# EAGLE design Teensy MouseV2.0 (EAGLE 6.5.0)
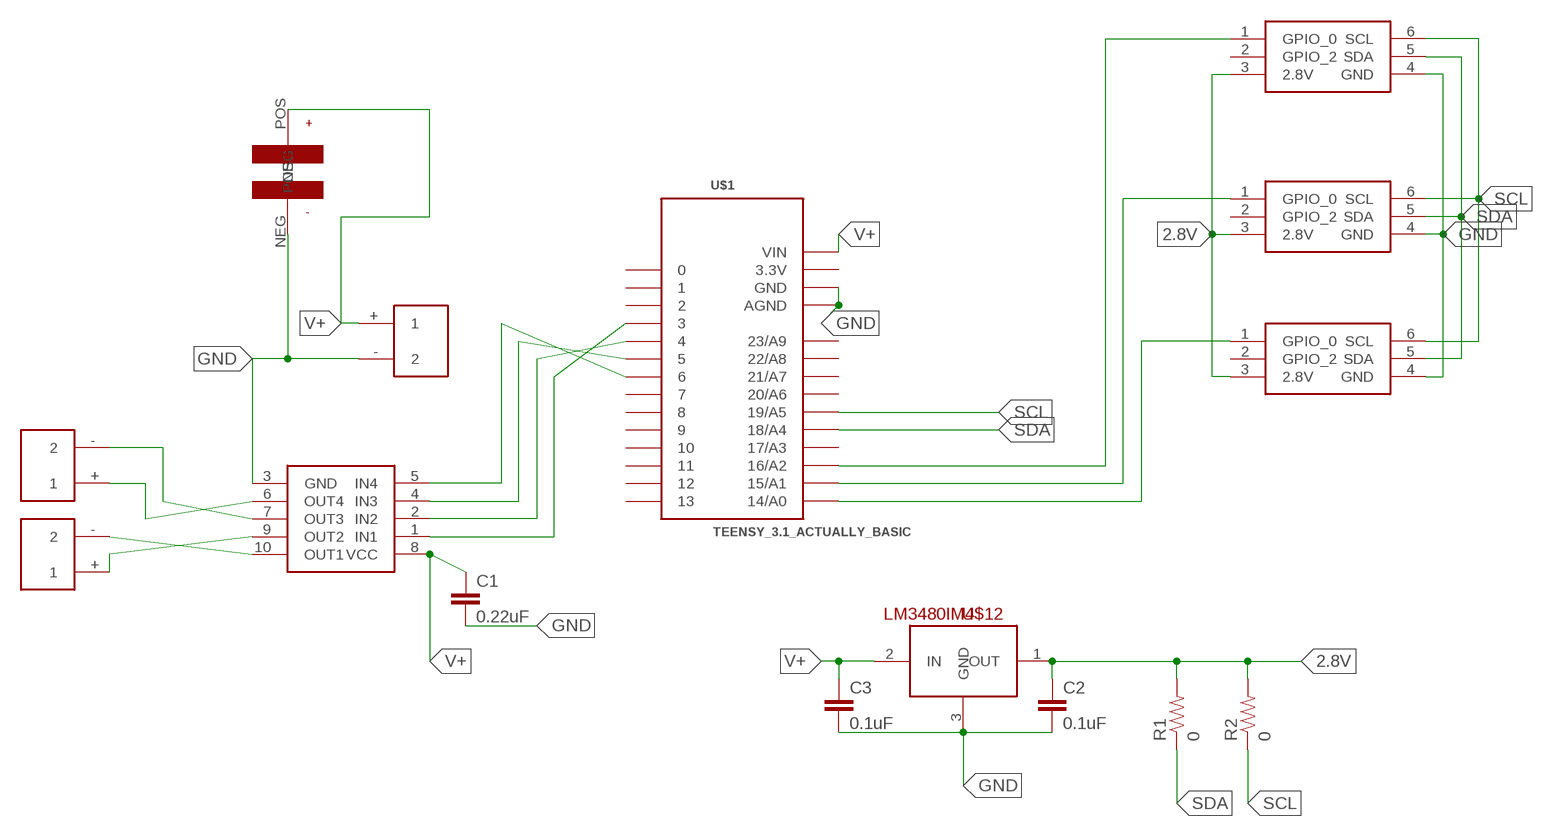
[diagram p0: schematic, sheet 1]

## Parts
C1  0.22uF  0.22UF50V-20%,+80%(0603)  [0603-CAP]
C2  0.1uF  0.1UF-25V(+80/-20%)(0603)  [0603-CAP]
C3  0.1uF  0.1UF-25V(+80/-20%)(0603)  [0603-CAP]
R1  0  0OHM1/10W5%(0603)  [0603]
R2  0  0OHM1/10W5%(0603)  [0603]
U$1  TEENSY_3.1_ACTUALLY_BASIC  [TEENSY_3.0_ACTUALLY_BASIC]
U$2  TEENSYMOUSEMOTORS  [TEENSYMOUSEMOTRS]
U$3  TEENSYMOUSEMOTORS  [TEENSYMOUSEMOTRS]
U$4  PICOBLADE2X  [PICOBLADE2X]
U$5  47UFBUTTONCAP  [ALUMINIUMELECTOCAP]
U$7  A3901DUALHBRIDGE  [10WFDFN]
U$9  PATRICK'S_ST_SENSOR_BOARD  [2X3HEADER]
U$10  PATRICK'S_ST_SENSOR_BOARD  [2X3HEADER]
U$11  PATRICK'S_ST_SENSOR_BOARD  [2X3HEADER]
U$12  LM3480IM4  [SOT23-3]

## Nets
2.8V: C2.1 R1.2 R2.2 U$9.3(2.8V) U$10.3(2.8V) U$11.3(2.8V) U$12.1(OUT)
GND: C1.2 C2.2 C3.2 U$1.AGND U$1.GND U$4.- U$5.NEG U$7.3(GND) U$9.4(GND) U$10.4(GND) U$11.4(GND) U$12.3(GND)
N$1: U$3.- U$7.7(OUT3)
N$2: U$3.+ U$7.6(OUT4)
N$3: U$2.- U$7.10(OUT1)
N$4: U$2.+ U$7.9(OUT2)
N$9: U$1.6 U$7.5(IN4)
N$10: U$1.5 U$7.4(IN3)
N$11: U$1.4 U$7.2(IN2)
N$12: U$1.3 U$7.1(IN1)
N$17: U$1.16/A2 U$9.1(GPIO_0)
N$18: U$1.15/A1 U$10.1(GPIO_0)
N$19: U$1.14/A0 U$11.1(GPIO_0)
SCL: R2.1 U$1.19/A5 U$9.6(SCL) U$10.6(SCL) U$11.6(SCL)
SDA: R1.1 U$1.18/A4 U$9.5(SDA) U$10.5(SDA) U$11.5(SDA)
V+: C1.1 C3.1 U$1.VIN U$4.+ U$5.POS U$7.8(VCC) U$12.2(IN)
Unconnected: U$1.0 U$1.1 U$1.2 U$1.7 U$1.8 U$1.9 U$1.10 U$1.11 U$1.12 U$1.13 U$1.17/A3 U$1.20/A6 U$1.21/A7 U$1.22/A8 U$1.23/A9 U$9.2(GPIO_2) U$10.2(GPIO_2) U$11.2(GPIO_2)

## Power pins joined to a net without a drawn wire
3.3V: U$1.3.3V

## Library data of the parts
C1 = SparkFun-Capacitors:0.22UF50V-20%,+80%(0603): CAP-09885; PROD_ID: CAP-09885
C2 C3 = SparkFun-Capacitors:0.1UF-25V(+80/-20%)(0603): CAP-00810 Ceramic Standard decoupling cap; PROD_ID: CAP-00810
R1 R2 = SparkFun-Resistors:0OHM1/10W5%(0603): RES-08609; PROD_ID: RES-08609
U$1 = Teensy3.0:TEENSY_3.1_ACTUALLY_BASIC
U$2 U$3 = 11Nick'sCustom:TEENSYMOUSEMOTORS
U$4 = 11Nick'sCustom:PICOBLADE2X
U$5 = 11Nick'sCustom:47UFBUTTONCAP
U$7 = 11Nick'sCustom:A3901DUALHBRIDGE
U$9-U$11 = 11Nick'sCustom:PATRICK'S_ST_SENSOR_BOARD
U$12 = SparkFun-PowerIC:LM3480IM4: Small package linear regulator

## Board
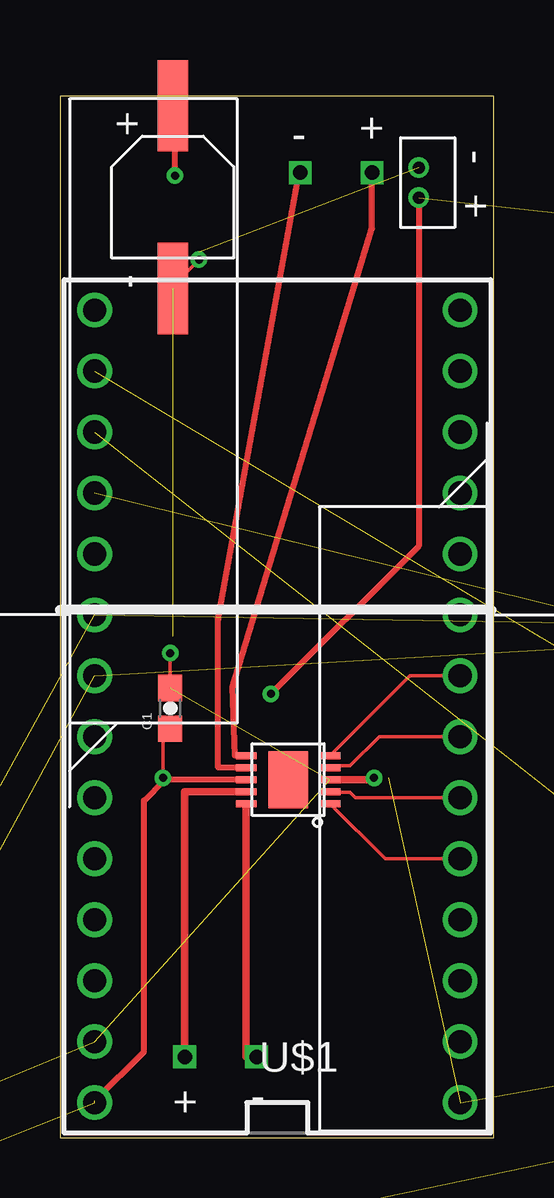
[diagram p1: board, top side]
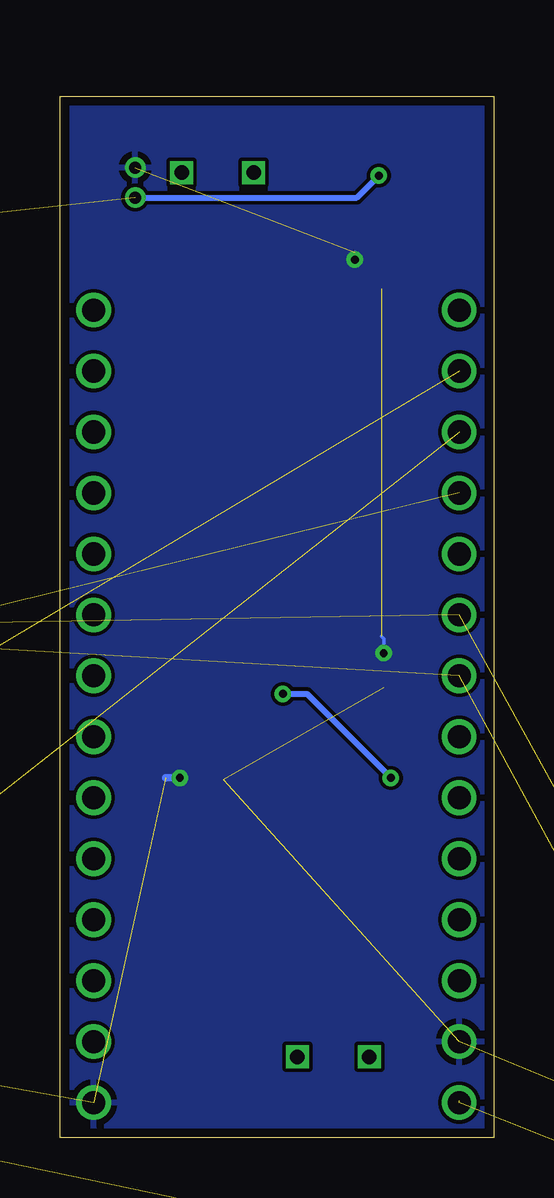
[diagram p2: board, bottom side, seen from below]

Size 18.1 x 43.4 mm. Coordinates in mm from the lower left corner, seen from the top.
Outline: 0,0 18.1,0 18.1,43.4 0,43.4 0,0
Copper layers (1*16): Top 0.0356mm / dielectric 1.5011mm / Bottom 0.0356mm
Design rules "LaenPCBOrder": minimum track width 6mil, minimum drill 13mil, track to track 6mil, track to pad 6mil, pad to pad 6mil, via to via 6mil, smd to smd 6mil, copper to edge 15mil, drill to drill 6mil, minimum pad ring 7mil, minimum via ring 7mil, stop-mask expansion 3mil, vias tented up to drill 0mil, thermal gap 10mil

### Footprints (pad centres in the part's own frame; a part is rotated, then mirrored left to right if it is on the bottom)
0603-CAP = smd 1.1 x 1: 1 -0.85,0; 2 0.85,0
0603 = smd 1.1 x 1: 1 -0.85,0; 2 0.85,0
TEENSY_3.0_ACTUALLY_BASIC = drill 0.965: 0 -5.08,7.62; 1 -5.08,5.08; 2 -5.08,2.54; 3 -5.08,0; 3.3V 10.16,5.08; 4 -5.08,-2.54; 5 -5.08,-5.08; 6 -5.08,-7.62; 7 -5.08,-10.16; 8 -5.08,-12.7; 9 -5.08,-15.24; 10 -5.08,-17.78; 11 -5.08,-20.32; 12 -5.08,-22.86; 13 10.16,-22.86; 14/A0 10.16,-20.32; 15/A1 10.16,-17.78; 16/A2 10.16,-15.24; 17/A3 10.16,-12.7; 18/A4 10.16,-10.16; 19/A5 10.16,-7.62; 20/A6 10.16,-5.08; 21/A7 10.16,-2.54; 22/A8 10.16,0; 23/A9 10.16,2.54; AGND 10.16,7.62; GND -5.08,10.16; VIN 10.16,10.16
TEENSYMOUSEMOTRS = drill 0.6 square: + -5.62,3.08; - -2.62,3.08
PICOBLADE2X = drill 0.5: + -0.625,0; - 0.625,0
ALUMINIUMELECTOCAP = smd 3.81 x 1.27: NEG -3.81,0; POS 3.81,0
10WFDFN = smd 0.85 x 0.3: 1 -1.75,1; 2 -1.75,0.5; 3 -1.75,0; 4 -1.75,-0.5; 5 -1.75,-1; 6 1.75,-1; 7 1.75,-0.5; 8 1.75,0; 9 1.75,0.5; 10 1.75,1 | smd 1.65 x 2.38: PAD 0,0
2X3HEADER = drill 1: 1 -2.54,-1.27; 2 0,-1.27; 3 2.54,-1.27; 4 2.54,1.27; 5 0,1.27; 6 -2.54,1.27
SOT23-3 = smd 0.8 x 0.9: 1 -0.95,-1; 2 0.95,-1; 3 0,1.1

### Placement (x,y rotation side)
C1  4.6,17.9 90 top
C2  -14.2,-2.1 0 top  (outside the outline)
C3  -14.2,-5.1 0 top  (outside the outline)
R1  -14.2,-8.1 0 top  (outside the outline)
R2  -14.2,-11.1 0 top  (outside the outline)
U$1  11.61,11.63 180 top
U$2  10.82,0.3 0 top
U$3  7.4,43.3 180 top
U$4  14.96,39.81 90 top
U$5  4.7,39.2 90 top
U$7  9.52,14.93 180 top
U$9  37.52,19.92 0 top  (outside the outline)
U$10  37.44,4.37 0 top  (outside the outline)
U$11  37.42,13.3 0 top  (outside the outline)
U$12  47.43,36.53 0 top  (outside the outline)

### Tracks (layer width: path | path; a pad name or v marks a point on that pad's centre or on a via)
2.8V  (6 unrouted)
GND  (via drill 0.33)  (11 unrouted)
  Top 0.152: U$5.NEG 4.7,35.5 v5.8,36.6 | C1.2 v4.6,20.2
  Top 0.305: U$7.3 13.03,14.93 v13.1,15
  Bottom 0.152: v5.8,36.6 5.8,36.9 | v4.6,20.2 4.6,20.8 4.7,20.9
  Bottom 0.305: v13.1,15 13.7,15
  pour Bottom: -0.3,43.7 18.7,43.9 18.3,-0.4 -0.2,-0.3
N$1
  Top 0.254: U$7.7 6.6,15.43 6.6,21.6 10.02,40.4 U$3.-
N$2
  Top 0.254: U$7.6 7.3,15.93 7.2,18.8 13.02,37.9 U$3.+
N$3
  Top 0.305: U$2.- 7.77,3.38 U$7.10
N$4
  Top 0.305: U$7.9 5.2,14.43 U$2.+
N$9
  Top 0.152: U$1.6 14.59,19.25 U$7.5
N$10
  Top 0.152: U$1.5 13.31,16.71 12.1,15.5 11.34,15.5 U$7.4
N$11
  Top 0.152: U$1.4 12.33,14.17 12.1,14.4 11.3,14.4 U$7.2
N$12
  Top 0.152: U$1.3 13.57,11.63 U$7.1
N$17  (1 unrouted)
N$18  (1 unrouted)
N$19  (1 unrouted)
SCL  (4 unrouted)
SDA  (4 unrouted)
V+  (via drill 0.33)  (3 unrouted)
  Top 0.152: v4.3,15 4.3,16.75 C1.1
  Top 0.254: U$7.8 4.37,14.93 | 1.45,1.55 3.5,3.6 3.5,14.06 4.37,14.93 | U$4.+ 14.96,24.66 v8.8,18.5 | v4.3,15 4.37,14.93 | v4.8,40.1 4.8,42.91 U$5.POS
  Bottom 0.254: v8.8,18.5 7.8,18.5 v4.3,15 | U$4.+ 5.71,39.19 v4.8,40.1